# EAGLE design schema (EAGLE 7.5.0)
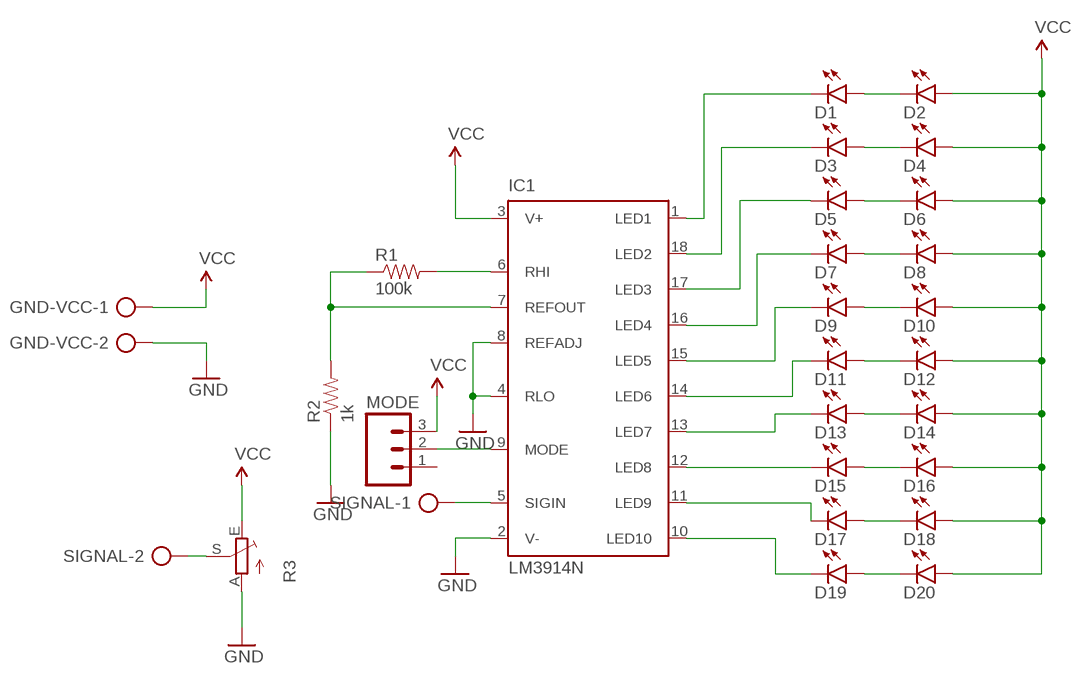
[diagram p0: schematic, sheet 1]

## Parts
D1  LED5MM  [LED5MM]
D2  LED5MM  [LED5MM]
D3  LED5MM  [LED5MM]
D4  LED5MM  [LED5MM]
D5  LED5MM  [LED5MM]
D6  LED5MM  [LED5MM]
D7  LED5MM  [LED5MM]
D8  LED5MM  [LED5MM]
D9  LED5MM  [LED5MM]
D10  LED5MM  [LED5MM]
D11  LED5MM  [LED5MM]
D12  LED5MM  [LED5MM]
D13  LED5MM  [LED5MM]
D14  LED5MM  [LED5MM]
D15  LED5MM  [LED5MM]
D16  LED5MM  [LED5MM]
D17  LED5MM  [LED5MM]
D18  LED5MM  [LED5MM]
D19  LED5MM  [LED5MM]
D20  LED5MM  [LED5MM]
GND-VCC  AK500/2  [AK500/2]
IC1  LM3914N  [DIL18]
MODE  M03LONGPADS  [1X03_LONGPADS]
R1  100k  RESISTORKIT  [AXIAL-0.3-KIT]
R2  1k  RESISTORKIT  [AXIAL-0.3-KIT]
R3  TRIM_EU-CA14H  [CA14H]
SIGNAL  AK500/2  [AK500/2]

## Nets
GND: GND-VCC.2 IC1.2(V-) IC1.4(RLO) IC1.8(REFADJ) R2.P$1 R3.A
N$1: D1.K(C) IC1.1(LED1)
N$2: D3.K(C) IC1.18(LED2)
N$3: D5.K(C) IC1.17(LED3)
N$4: D7.K(C) IC1.16(LED4)
N$5: D9.K(C) IC1.15(LED5)
N$6: D11.K(C) IC1.14(LED6)
N$7: D13.K(C) IC1.13(LED7)
N$8: D15.K(C) IC1.12(LED8)
N$9: D17.K(C) IC1.11(LED9)
N$10: D19.K(C) IC1.10(LED10)
N$11: D1.A D2.K(C)
N$12: D3.A D4.K(C)
N$13: D5.A D6.K(C)
N$14: D7.A D8.K(C)
N$15: D9.A D10.K(C)
N$16: D11.A D12.K(C)
N$17: D13.A D14.K(C)
N$18: D15.A D16.K(C)
N$19: D17.A D18.K(C)
N$20: D19.A D20.K(C)
N$22: IC1.6(RHI) R1.P$2
N$23: IC1.7(REFOUT) R1.P$1 R2.P$2
N$25: IC1.9(MODE) MODE.2
N$27: IC1.5(SIGIN) SIGNAL.1
N$28: R3.S SIGNAL.2
VCC: D2.A D4.A D6.A D8.A D10.A D12.A D14.A D16.A D18.A D20.A GND-VCC.1 IC1.3(V+) MODE.3 R3.E
Unconnected: MODE.1

## Library data of the parts
D1-D20 = SparkFun-LED:LED: LEDs Standard schematic elements and footprints for 5mm, 3mm, 1206, and 0603 sized LEDs. 5mm - Spark Fun Electronics SKU : COM-00529 (and others)
GND-VCC SIGNAL = con-ptr500:AK500/2: CONNECTOR; OC_FARNELL: unknown; OC_NEWARK: unknown
IC1 = national-semiconductor:LM391: Dot/Bar Display Driver Source: Data sheet LM3915 <http://www.national.com/ds/LM/LM3915.pdf> Data sheet LM3914 <http://www.national.com/ds/LM/LM3914.pdf>
MODE = SparkFun-Connectors:M03: Header 3 Standard 3-pin 0.1" header. Use with straight break away headers (SKU : PRT-00116), right angle break away headers (PRT-00553), swiss pins (PRT-00743), machine pins (PRT-00117), and female headers (PRT-00115). Molex polarized connector foot print use with SKU : PRT-08232 with associated crimp pins and housings.
R1 R2 = SparkFun-Passives:RESISTOR: Resistor Basic schematic elements and footprints for 0603, 1206, and PTH resistors.
R3 = pot:TRIM_EU-: POTENTIOMETER

## Board
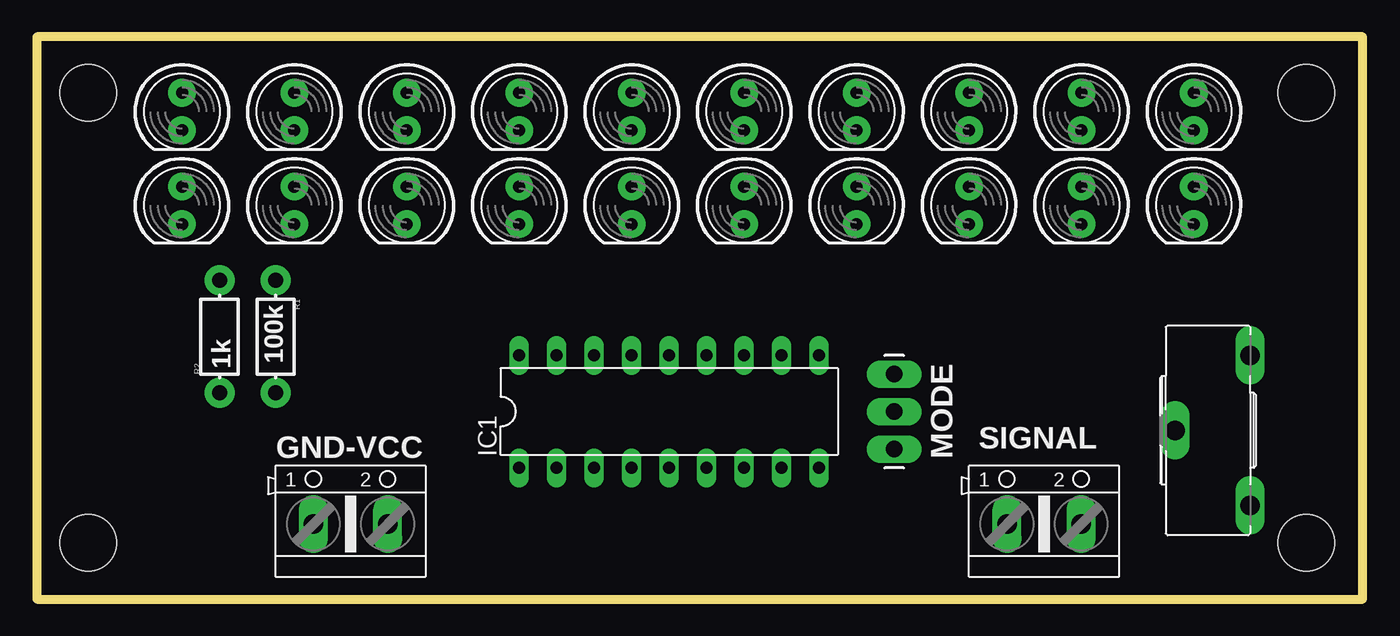
[diagram p1: board, top side]
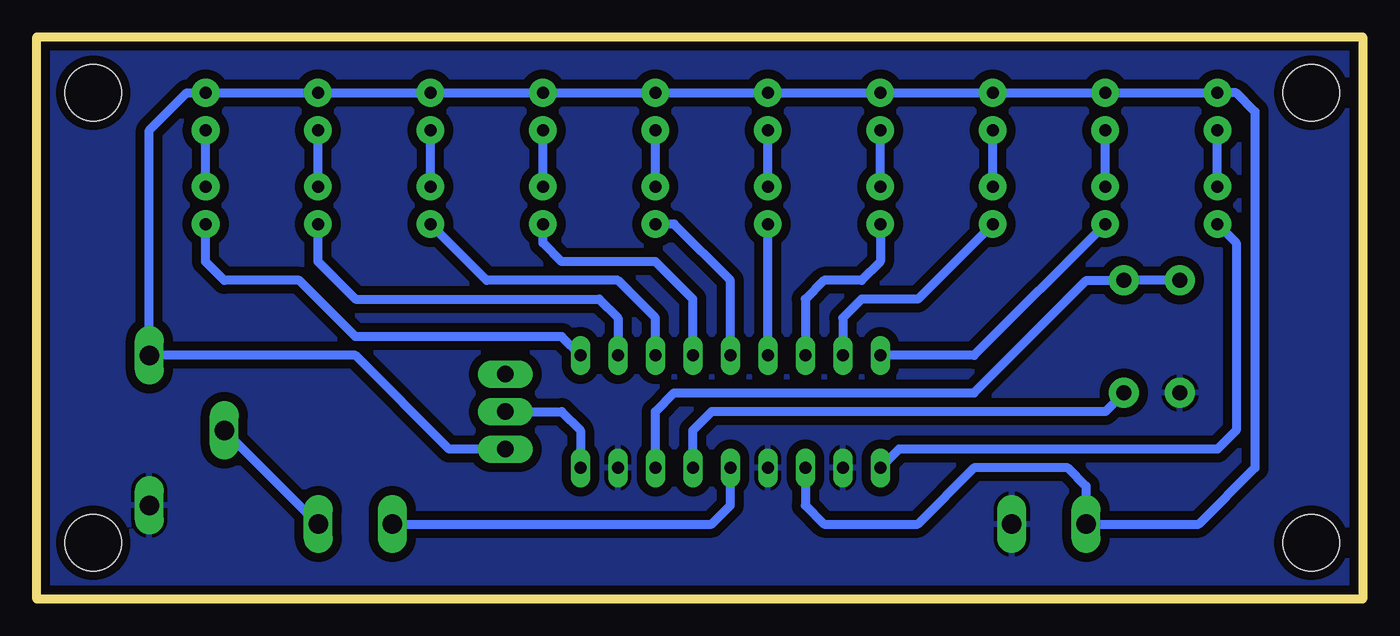
[diagram p2: board, bottom side, seen from below]

Size 89.84 x 38.08 mm. Coordinates in mm from the lower left corner, seen from the top.
Outline: 89.84,0 89.84,38.08 0,38.08 0,0 89.84,0
Copper layers (1*16): Top 0.035mm / dielectric 1.5mm / Bottom 0.035mm
Design rules "default *": minimum track width 24mil, minimum drill 24mil, track to track 24mil, track to pad 24mil, pad to pad 24mil, via to via 24mil, smd to smd 8mil, copper to edge 24mil, drill to drill 8mil, minimum pad ring 10mil, minimum via ring 8mil, stop-mask expansion 4mil, vias tented up to drill 0mil, thermal gap 10mil
Holes 3.81 mm at 86.03,3.81 86.03,34.29 3.48,34.29 3.48,3.81

### Footprints (pad centres in the part's own frame; a part is rotated, then mirrored left to right if it is on the bottom)
LED5MM = drill 0.813 pad 1.88: A -1.27,0; K 1.27,0
AK500/2 = drill 1.321 long: 1 -2.515,0; 2 2.515,0
DIL18 = drill 0.813 long: 1 -10.16,-3.81; 2 -7.62,-3.81; 3 -5.08,-3.81; 4 -2.54,-3.81; 5 0,-3.81; 6 2.54,-3.81; 7 5.08,-3.81; 8 7.62,-3.81; 9 10.16,-3.81; 10 10.16,3.81; 11 7.62,3.81; 12 5.08,3.81; 13 2.54,3.81; 14 0,3.81; 15 -2.54,3.81; 16 -5.08,3.81; 17 -7.62,3.81; 18 -10.16,3.81
1X03_LONGPADS = drill 1.118 pad 1.88 long: 1 0,0; 2 2.54,0; 3 5.08,0
AXIAL-0.3-KIT = drill 1.016 pad 2.032: P$1 -3.81,0; P$2 3.81,0
CA14H = drill 1.321 long: A -5.08,0; E 5.08,0; S 0,5.08

### Placement (x,y rotation side)
D1  9.83,26.67 270 top
D2  9.83,33.02 270 top
D3  17.45,26.67 270 top
D4  17.45,33.02 270 top
D5  25.07,26.67 270 top
D6  25.07,33.02 270 top
D7  32.69,26.67 270 top
D8  32.69,33.02 270 top
D9  40.31,26.67 270 top
D10  40.31,33.02 270 top
D11  47.93,26.67 270 top
D12  47.93,33.02 270 top
D13  55.55,26.67 270 top
D14  55.55,33.02 270 top
D15  63.17,26.67 270 top
D16  63.17,33.02 270 top
D17  70.79,26.67 270 top
D18  70.79,33.02 270 top
D19  78.41,26.67 270 top
D20  78.41,33.02 270 top
GND-VCC  21.26,5.08 0 top
IC1  42.85,12.7 0 top
MODE  58.09,15.24 270 top
R1  16.18,17.78 270 top
R2  12.37,17.78 90 top
R3  82.22,11.43 90 top
SIGNAL  68.25,5.08 0 top

### Tracks (layer width: path | path; a pad name or v marks a point on that pad's centre or on a via)
GND
  pour Bottom: 89.84,0 -0.33,0 -0.33,38.1 89.84,38.1
N$1
  Bottom 0.61: D1.K 8.56,24.13 8.56,11.43 9.83,10.16 31.42,10.16 IC1.1
N$2
  Bottom 0.61: D3.K 26.34,16.51 IC1.18
N$3
  Bottom 0.61: D5.K 30.15,20.32 33.96,20.32 35.23,19.05 IC1.17
N$4
  Bottom 0.61: D7.K 32.69,22.86 33.96,21.59 36.5,21.59 37.77,20.32 IC1.16
N$5
  Bottom 0.61: IC1.15 D9.K
N$6
  Bottom 0.61: IC1.14 42.85,21.59 46.66,25.4 D11.K
N$7
  Bottom 0.61: IC1.13 45.39,20.32 47.93,22.86 54.28,22.86 55.55,24.13 D13.K
N$8
  Bottom 0.61: IC1.12 47.93,19.05 50.47,21.59 59.36,21.59 D15.K
N$9
  Bottom 0.61: D17.K 70.79,22.86 68.25,20.32 51.74,20.32 50.47,19.05 IC1.11
N$10
  Bottom 0.61: IC1.10 54.28,17.78 68.25,17.78 72.06,21.59 77.14,21.59 78.41,22.86 D19.K
N$11
  Bottom 0.61: D1.A D2.K
N$12
  Bottom 0.61: D3.A D4.K
N$13
  Bottom 0.61: D5.A D6.K
N$14
  Bottom 0.61: D7.A D8.K
N$15
  Bottom 0.61: D9.A D10.K
N$16
  Bottom 0.61: D11.A D12.K
N$17
  Bottom 0.61: D13.A D14.K
N$18
  Bottom 0.61: D15.A D16.K
N$19
  Bottom 0.61: D17.A D18.K
N$20
  Bottom 0.61: D19.A D20.K
N$22
  Bottom 0.61: IC1.6 45.39,11.43 44.12,12.7 17.45,12.7 R1.P$2
N$23
  Bottom 0.61: IC1.7 47.93,12.7 46.66,13.97 26.34,13.97 18.72,21.59 R1.P$1 R2.P$2
N$25
  Bottom 0.61: MODE.2 54.28,12.7 53.01,11.43 IC1.9
N$27
  Bottom 0.61: SIGNAL.1 44.12,5.08 42.85,6.35 IC1.5
N$28
  Bottom 0.61: R3.S 72.06,6.35 SIGNAL.2
VCC
  Bottom 0.61: MODE.3 61.9,10.16 68.25,16.51 R3.E 82.22,31.75 79.68,34.29 D20.A D18.A D16.A D14.A D12.A D10.A D8.A D6.A D4.A D2.A 8.56,34.29 7.29,33.02 7.29,8.89 11.1,5.08 GND-VCC.1 18.74,7.64 19.99,8.89 26.34,8.89 30.15,5.08 36.5,5.08 37.77,6.35 IC1.3